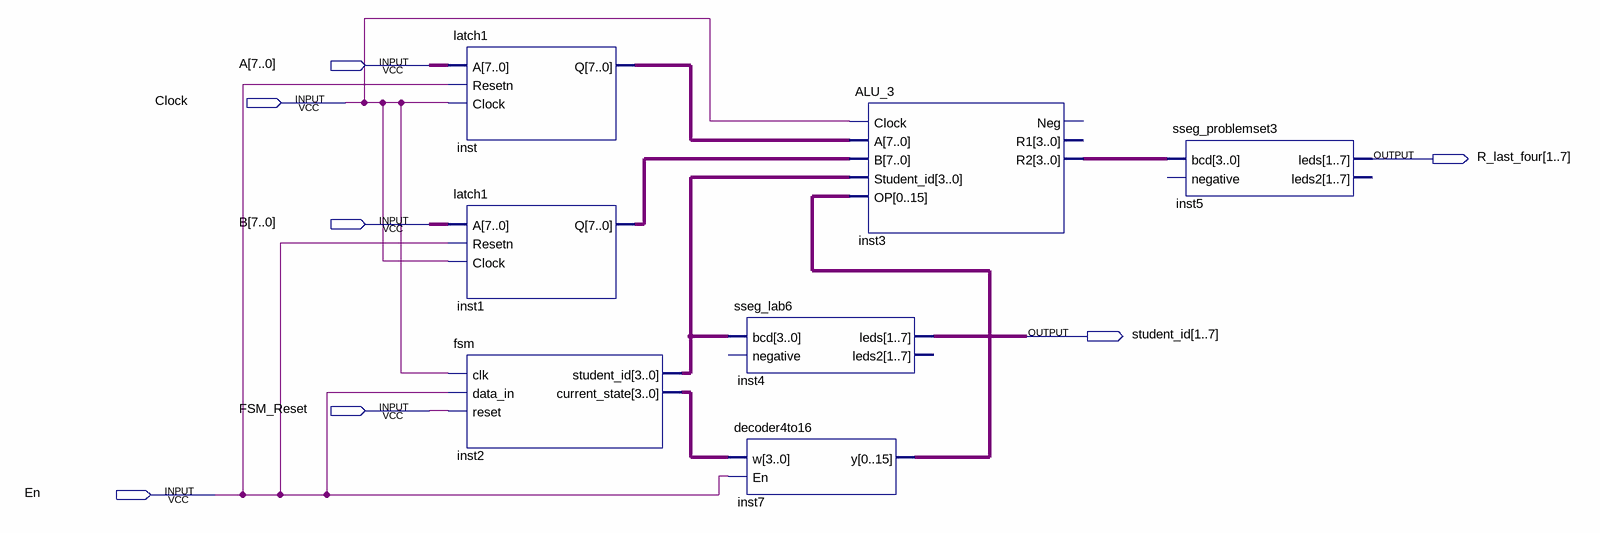
[diagram p0: schematic sheet]
// Quartus schematic lab6_problemset3.bdf as structural Verilog: 7 symbols, 7 pins
module lab6_problemset3 (
  input  [7:0] A,
  input  Clock,
  input  [7:0] B,
  input  FSM_Reset,
  input  En,
  output [1:7] R_last_four,
  output [1:7] student_id
);

  wire [3:0] inst2_current_state, inst2_student_id, inst3_r2;
  wire [7:0] inst1_q, inst_q;
  wire [15:0] inst7_y;

  latch1 inst (.A(A), .Resetn(En), .Clock(Clock), .Q(inst_q));
  latch1 inst1 (.A(B), .Resetn(En), .Clock(Clock), .Q(inst1_q));
  fsm inst2 (
    .clk(Clock), .data_in(En), .reset(FSM_Reset), .student_id(inst2_student_id),
    .current_state(inst2_current_state));
  sseg_lab6 inst4 (.bcd(inst2_student_id), .leds(student_id));  // open: negative, leds2
  decoder4to16 inst7 (.w(inst2_current_state), .En(En), .y(inst7_y));
  ALU_3 inst3 (
    .Clock(Clock), .A(inst_q), .B(inst1_q), .Student_id(inst2_student_id), .OP(inst7_y), .R2(inst3_r2));  // open: Neg, R1
  sseg_problemset3 inst5 (.bcd(inst3_r2), .leds(R_last_four));  // open: negative, leds2
endmodule
